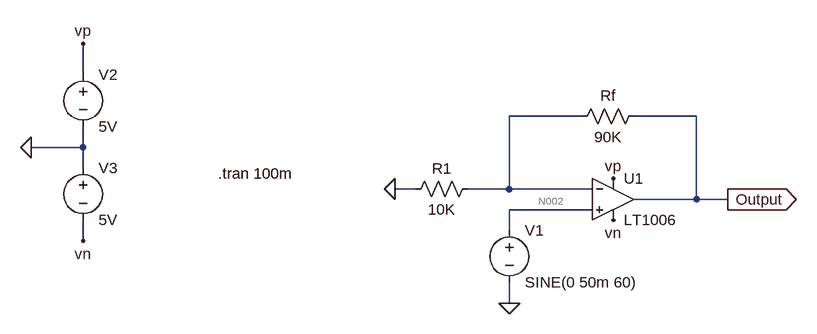
[diagram p0: schematic Real Op_Amp.asc]
Real Op_Amp.asc, the LTspice schematic file:
Version 4.1
SHEET 1 880 680
WIRE -624 -48 -624 -96
WIRE 144 16 32 16
WIRE 320 16 224 16
WIRE -624 64 -624 32
WIRE -624 64 -704 64
WIRE -624 96 -624 64
WIRE -112 128 -144 128
WIRE 32 128 32 16
WIRE 32 128 -32 128
WIRE 160 128 32 128
WIRE 320 144 320 16
WIRE 320 144 224 144
WIRE 368 144 320 144
WIRE 160 160 32 160
WIRE 32 192 32 160
WIRE -624 208 -624 176
WIRE 32 304 32 272
FLAG 192 112 vp
FLAG 192 176 vn
FLAG 368 144 Output
IOPIN 368 144 Out
FLAG 32 304 0
FLAG -144 128 0
FLAG -704 64 0
FLAG -624 208 vn
FLAG -624 -96 vp
SYMBOL OpAmps\\LT1006 192 80 R0
SYMATTR InstName U1
SYMBOL voltage 32 176 R0
WINDOW 123 0 0 Left 0
WINDOW 39 0 0 Left 0
SYMATTR InstName V1
SYMATTR Value SINE(0 50m 60)
SYMBOL res -16 112 R90
WINDOW 0 0 56 VBottom 2
WINDOW 3 32 56 VTop 2
SYMATTR InstName R1
SYMATTR Value 10K
SYMBOL res 240 0 R90
WINDOW 0 0 56 VBottom 2
WINDOW 3 32 56 VTop 2
SYMATTR InstName Rf
SYMATTR Value 90K
SYMBOL voltage -624 -64 R0
WINDOW 123 0 0 Left 0
WINDOW 39 0 0 Left 0
SYMATTR InstName V2
SYMATTR Value 5V
SYMBOL voltage -624 80 R0
WINDOW 123 0 0 Left 0
WINDOW 39 0 0 Left 0
SYMATTR InstName V3
SYMATTR Value 5V
TEXT -416 104 Left 2 !.tran 100m

The netlist it stands for:
* Real Op_Amp.asc
X§U1 N002 N001 vp vn Output LT1006  ; pins In+ In- V+ V- OUT
V1 N002 0 SINE(0 50m 60)
R1 N001 0 10K
Rf Output N001 90K
V2 vp 0 5V
V3 0 vn 5V
.tran 100m
.lib LTC.lib
.backanno
.end

* Results of the author's LTspice run, read from the files saved beside the schematic
* Operating Point, zero values left out:
*   V(vn) = -5 V
*   V(output) = -792.4 µV
*   V(vp) = 5 V
*   I(Rf) = -8.805 nA
*   I(V3) = -360 µA
*   I(V1) = 8.805 nA
*   I(V2) = -360 µA
*   Ix(u1:1) = -8.805 nA
*   Ix(u1:2) = -8.805 nA
*   Ix(u1:3) = 360 µA
*   Ix(u1:4) = -360 µA
*   Ix(u1:5) = 8.805 nA
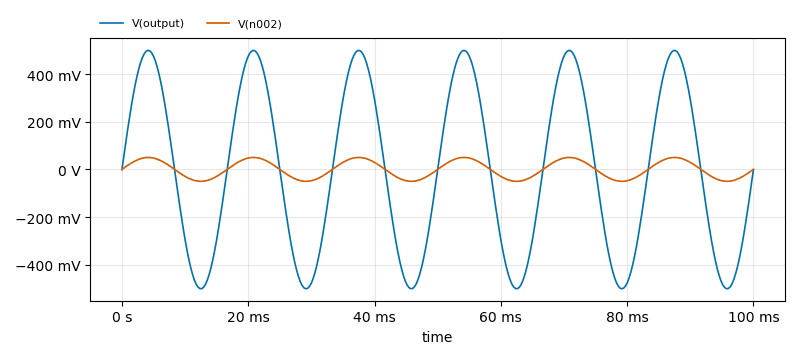
[diagram p1: Transient Analysis of Real Op_Amp.asc, plotted from the saved traces]
* Transient Analysis, 1 run:
*   V(output): min -500.7 mV, max 499.2 mV, average -792.7 µV, rms 353.6 mV, last -1.222 mV
*   V(n002): min -50 mV, max 50 mV, average -22.18 nV, rms 35.36 mV, last 0 V